# Altium schematic sheet Sheet1.SchDoc
size A4; DrawnBy: Senuda Ratnayake; SheetNumber: 1; SheetTotal: 1
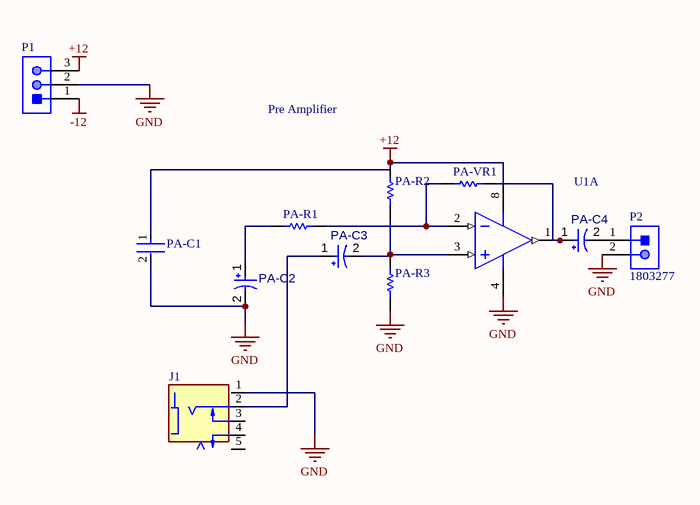
[diagram p0: Sheet1.SchDoc]

## Parts
J1  35RAPC4BH3  [SWITCHCRAFT_35RAPC4BH3]  (value not drawn)
P1  B3P-VH(LF)(SN)  [JST-B3P-VH(LF)(SN)-3_V]  (value not drawn)
P2  1803277  [PHOE-1803277_V]
PA-C1  100n  [FP-VY2102M29Y5US6TV7-MFG]  (value not drawn)
PA-C2  ECA1HM100  [CAPPR55-200-1100X500X1200]  (value not drawn)
PA-C3  ECA-1HHG010  [CAPPR55-200-1100X500X1200]  (value not drawn)
PA-C4  ECA1HM100  [CAPPR55-200-1100X500X1200]  (value not drawn)
PA-R1  MFR-25FBF52-2K21  [RESA60-630X240]  (value not drawn)
PA-R2  100k  [RESA60-630X240]  (value not drawn)
PA-R3  100k  [RESA60-630X240]  (value not drawn)
PA-VR1  MFR-25FBF52-2K21  [RESA60-630X240]  (value not drawn)
U1  NE5532P  [P0008A]  (value not drawn)  (part A of 2)

## Nets
+12: P1.3 PA-C1.1 PA-C4.1 PA-R2.2 PA-VR1.2 U1.1(OUT1) U1.8(VCC+)
-12: P1.1
GND: J1.1 P1.2 P2.2 PA-C1.2 PA-C2.2 PA-R3.1 U1.4(VCC-)
NetJ1_2: J1.2 PA-C3.1
NetP2_1: P2.1 PA-C4.2
NetPA-C2_1: PA-C2.1 PA-R1.1
NetPA-C3_2: PA-C3.2 PA-R2.1 PA-R3.2 U1.3(IN1+)
NetPA-R1_2: PA-R1.2 PA-VR1.1 U1.2(IN1-)

Not connected (* = marked no-connect by the designer): J1 3 4 5

## Notes on the sheet
- Pre Amplifier
- Title
- Size:
- Date:
- A4
- Number:
- Time:
- Revision:
- Sheet
- of
- File:

## Library data of the parts
J1 = 35RAPC4BH3: PC horizontal mount Jack stereo threaded bushing 3.5MM, 35 Series | Switchcraft 35RAPC4BH3; MF: Switchcraft Inc.; SnapEDA_Link: https://www.snapeda.com/parts/35RAPC4BH3/SWITCHCRAFT/view-part/?ref=snap; Package: None; Value: *; MP: 35RAPC4BH3; Check_prices: https://www.snapeda.com/parts/35RAPC4BH3/SWITCHCRAFT/view-part/?ref=eda
P1 = CMP-002-00026-2: Male Header, Pitch 3.96 mm, 1 x 3 Position, Height 10.9 mm, Tail Length 3.7 mm, -25 to 85 degC, RoHS, Bulk; Manufacturer: JST; Case/Package: B3P-VH(LF)(SN); Connector Type: Header; Datasheet Version: May-16; Mounting Technology: TH; Package Description: Male Header, Pitch 3.96 mm, 1 x 3 Position, Height 10.9 mm, Tail Length 3.7 mm; Gender: Male; Manufacturer URL: http://www.jst.com/home2.html; Package Reference: B3P-VH(LF)(SN); Datasheet URL: http://www.jst-mfg.com/product/pdf/eng/eVH.pdf; Min Operating Temperature: -25°C; Max Operating Temperature: 85°C; RoHS Compliant: Unknown
P2 = CMP-002-00014-2: Male Header, Pitch 3.81 mm, 1 x 2 Position, Height 7.25 mm, Tail Length 3.4 mm, RoHS, Bulk; Manufacturer: Phoenix Contact; Voltage Rating: 160V; Current Rating: 8A; Rows: 1; Mounting Technology: TH; Contact Plating: Tin; Case/Package: 1803277; Gender: Male; Diameter: 7.25mm; Datasheet Version: Feb-14; Colour: Green; Pins: 2; Lead Pitch: 0.15inch; Connector Type: Header; Package Quantity: 50; Max Current Rating: 8A; Manufacturer URL: http://www.phoenixcontact.com/; Packaging: Bulk; RoHS Compliant: True; Datasheet URL: https://datasheet.ciiva.com/16096/1803277-16096845.pdf; Package Reference: 1803277; Package Description: Male Header, Pitch 3.81 mm, 1 x 2 Position, Height 7.25 mm, Tail Length 3.4 mm
PA-C1 = CMP-00030-42817980-1: VY2102M29Y5US6TV7 Cap Ceramic Suppression X1/Y2 0.001uF 440VAC/300VAC Y5U 20% (7.5 X 5mm) Radial 7.5mm 125C T/R; Capacitance: 1nF; Lead/Base Style: Kinked; Lead Diameter: 600µm; Voltage: 300V; Voltage Rating: 1kV; Case/Package: Radial; Height: 10.5mm; REACH SVHC: Unknown; Packaging: Tape & Reel (TR); Lead Free: Lead Free; RoHS: Compliant; Min Operating Temperature: -40°C; Max Operating Temperature: 125°C; Termination: Radial; Composition: Ceramic; Depth: 5mm; Dielectric: Y5U; Diameter: 7.5mm; Lead Pitch: 7.5mm; Schedule B: 8532230060, 8532230060; Radiation Hardening: No; Tolerance: 20%; Height - Seated (Max): 11.5062mm; Voltage Rating (AC): 300V; Material: Ceramic; Mount: Through Hole; NexarPartId: 42817980
PA-C2 PA-C4 = CMP-001-00025-7: Aluminum Electrolytic Capacitor, 10 uF, +/- 20%, 50 V, -40 to 85 degC, 2-Pin THD, RoHS, Bulk; Manufacturer: Panasonic; Ripple Current (AC): 65mA; Voltage Rating: 50V; Value: 10µF; Mounting Technology: TH; RoHS Compliant: True; Capacitor Type: Electrolytic; Datasheet Version: Rev. 05, 10/2016; Min Operating Temperature: -40°C; Packaging: Bulk; Ripple Current: 65mA; Tolerance: 20%; Max Operating Temperature: 85°C; Datasheet URL: https://industrial.panasonic.com/cdbs/www-data/pdf/RDF0000/ABA0000C1218.pdf; Lead Pitch: 2mm; Pins: 2; Diameter: 5mm; Manufacturer URL: http://www.panasonic.com/; Package Reference: CAPPR55-200-1100X500X1200; Package Description: 2-Pin Radial Lead, Dia 5 mm, Height 12 mm; Case/Package: Radial; Package Quantity: 200
PA-C3 = CMP-001-00024-7: Aluminum Electrolytic Capacitor, 1 uF, +/- 20%, 50 V, -55 to 105 degC, 2-Pin THD, RoHS, Bulk; Manufacturer: Panasonic; Voltage Rating: 50V; Ripple Current: 10mA; Value: 1µF; Packaging: Bulk; Package Quantity: 200; Tolerance: 20%; Min Operating Temperature: -55°C; Diameter: 5mm; Capacitor Type: Electrolytic; Datasheet Version: Mar-05; Ripple Current (AC): 10mA; Manufacturer URL: http://www.panasonic.com/; Case/Package: Radial; Mounting Technology: TH; Pins: 2; Package Reference: CAPPR55-200-1100X500X1200; Package Description: 2-Pin Radial Lead, Dia 5 mm, Height 12 mm; RoHS Compliant: True; Max Operating Temperature: 105°C; Lead Pitch: 2mm; Datasheet URL: https://datasheet.ciiva.com/7275/94060-7275472.pdf
PA-R1 PA-VR1 = CMP-1659-00065-1: Axial Resistor, 2.21 KOhm, +/- 1%, 0.25 W, -55 to 155 degC, 2-Pin THD, RoHS, Bulk; Case\Package: 0402; Current Rating: 300 mA; Shielding: Unshielded; Resistance: 0.15 Ohm; Radiation Hardening: No; Mount: Surface Mount; REACH SVHC: No SVHC; Height: 0.02 inch; ComponentLink1URL: http://www.yageo.com/; Case Code (Imperial): 0402; ComponentLink2Description: Datasheet; ComponentLink1Description: Manufacturer URL; Max Operating Temperature: 125 degC; DatasheetVersion: Apr-13; PackageReference: MFR-25; RoHSCompliant: true; PackageDescription: 2-Pin Axial Lead, Dia 2.4 mm, Body Length 6.3 mm; ComponentLink2URL: http://www.yageo.com/documents/recent/Yageo%20LR_MFR_2013.pdf; Pins: 2; Length: 0.04 inch; Case Code (Metric): 1005; Packaging: Tape and Reel; Width: 0.02 inch; Min Operating Temperature: -55 degC; Package Quantity: 10000
PA-R2 PA-R3 = CMP-1659-00073-1: Axial Resistor, 100 KOhm, +/- 1%, 0.25 W, -55 to 155 degC, 2-Pin THD, RoHS, Bulk; Voltage Rating: 250 V; Power Rating: 250 mW; Resistance: 475 Ohm; PackageDescription: 2-Pin Axial Lead, Dia 2.4 mm, Body Length 6.3 mm; PackageReference: MFR-25; Length: 0.248 inch; ComponentLink2Description: Datasheet; Packaging: Bulk; DatasheetVersion: Apr-13; Package Quantity: 200; Min Operating Temperature: -55 degC; ComponentLink2URL: http://www.yageo.com/documents/recent/Yageo%20LR_MFR_2013.pdf; RoHSCompliant: true; ComponentLink1URL: http://www.yageo.com/; Tolerance: 1%; Case\Package: Axial; Mount: Through Hole; ComponentLink1Description: Manufacturer URL; Max Operating Temperature: 155 degC
U1 = CMP-0017-00910-2: Dual Low-Noise High-Speed Audio Operational Amplifier, 10 to 30 V, 0 to 70 degC, 8-pin DIP (P8), Pb-Free (RoHS); Manufacturer: Texas Instruments; Iq per channel(Max)(mA): 4; Slew Rate(Typ)(V/us): 9; Vn at 1kHz(Typ)(nV/rtHz): 5; IIB(Max)(pA): 800000; Total Supply Voltage(Max)(+5V is 5, +/-5V is 10): 30; GBW(Typ)(MHz): 10; CMRR(Min)(dB): 70; Number of Channels: 2; Sub Family: General Purpose Amplifier, High Supply Voltage Amplifier (>=30V), Low Noise Amp (<=10nV/rtHz); ComponentLink2URL: http://www.ti.com/lit/ds/symlink/ne5532.pdf; PackageReference: P0008A; PackageDescription: 8-Pin Plastic In-Line, Body 9.59 x 6.35 mm, Pitch 2.54 mm; ComponentLink1Description: Manufacturer URL; Eco-Plan: Pb-Free (RoHS); Mounting Technology: Through Hole; Code_JEDEC: MS-001; PackageVersion: 4040082/E, 04/2010; DatasheetVersion: SLOS075I; ComponentLink3URL: http://www.ti.com/litv/pdf/mpdi001b; ComponentLink2Description: Datasheet; Vio (25C)(Max)(mV): 4; PartNumber: NE5532P; ComponentLink3Description: Package Specification; Total Supply Voltage(Min)(+5V is 5, +/-5V is 10): 10; ComponentLink1URL: http://www.ti.com/